# Altium project WIFI_BLE_Sound.PrjPcb
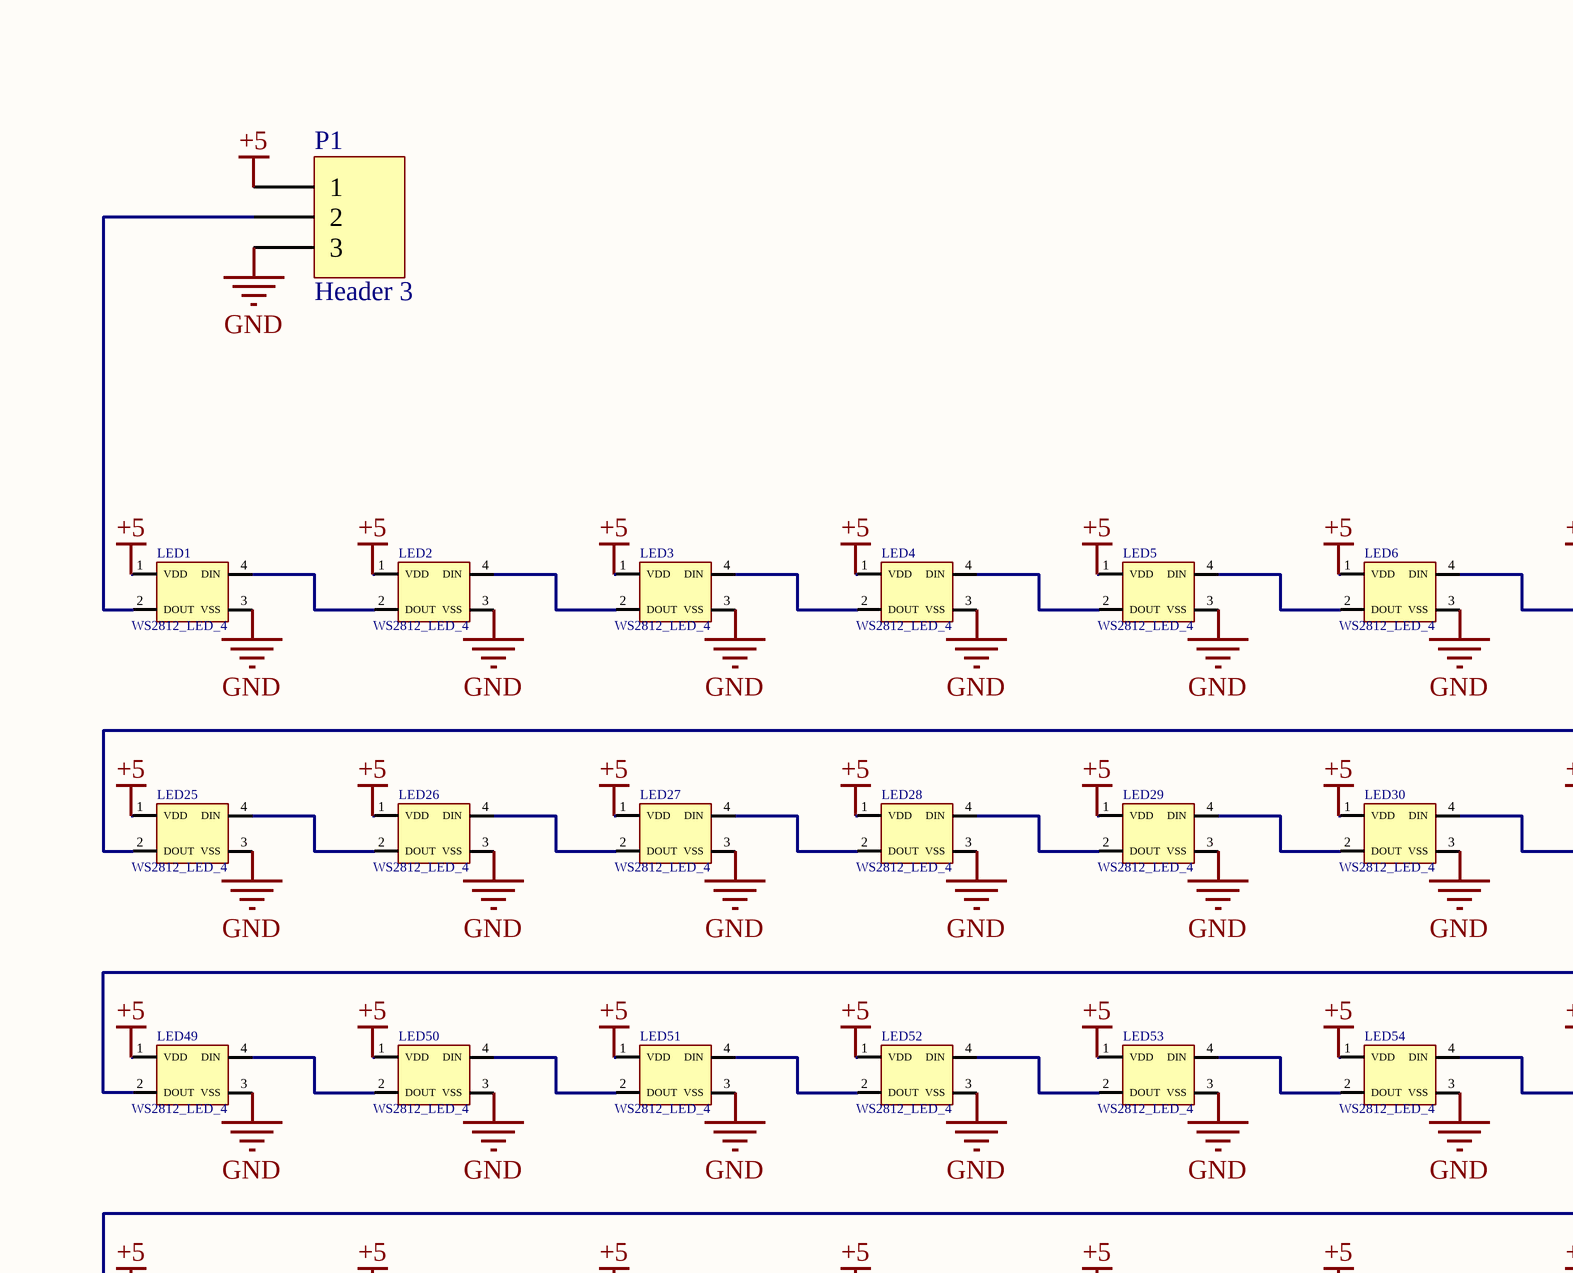
[diagram p0: Sheet1.SchDoc, top column 1 of 4]
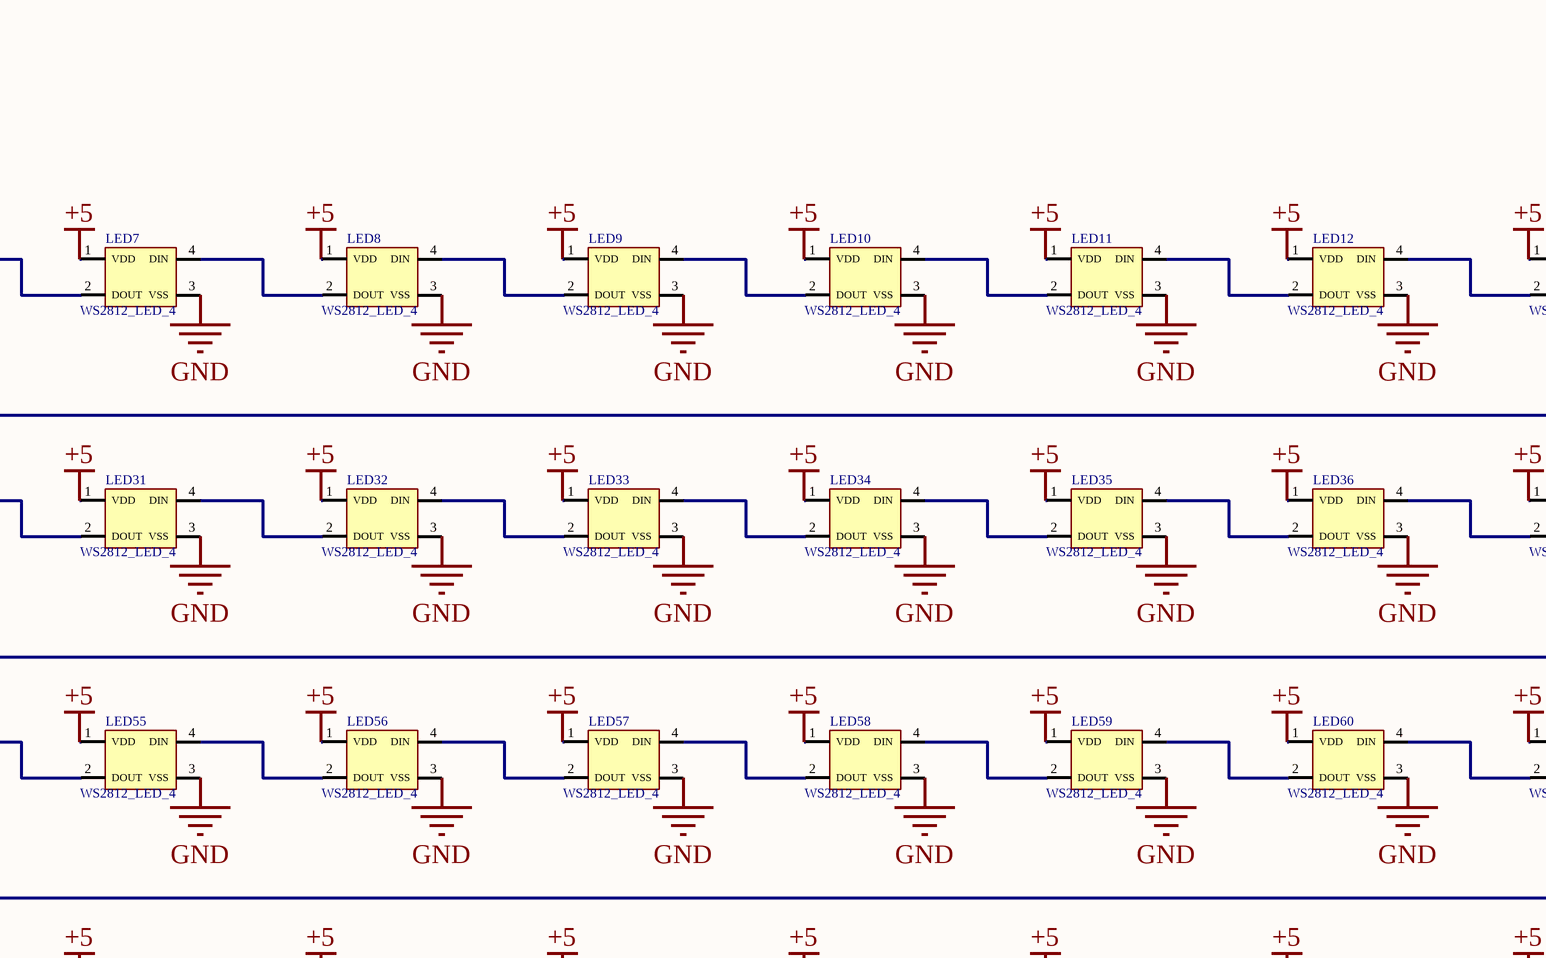
[diagram p1: Sheet1.SchDoc, top column 2 of 4]
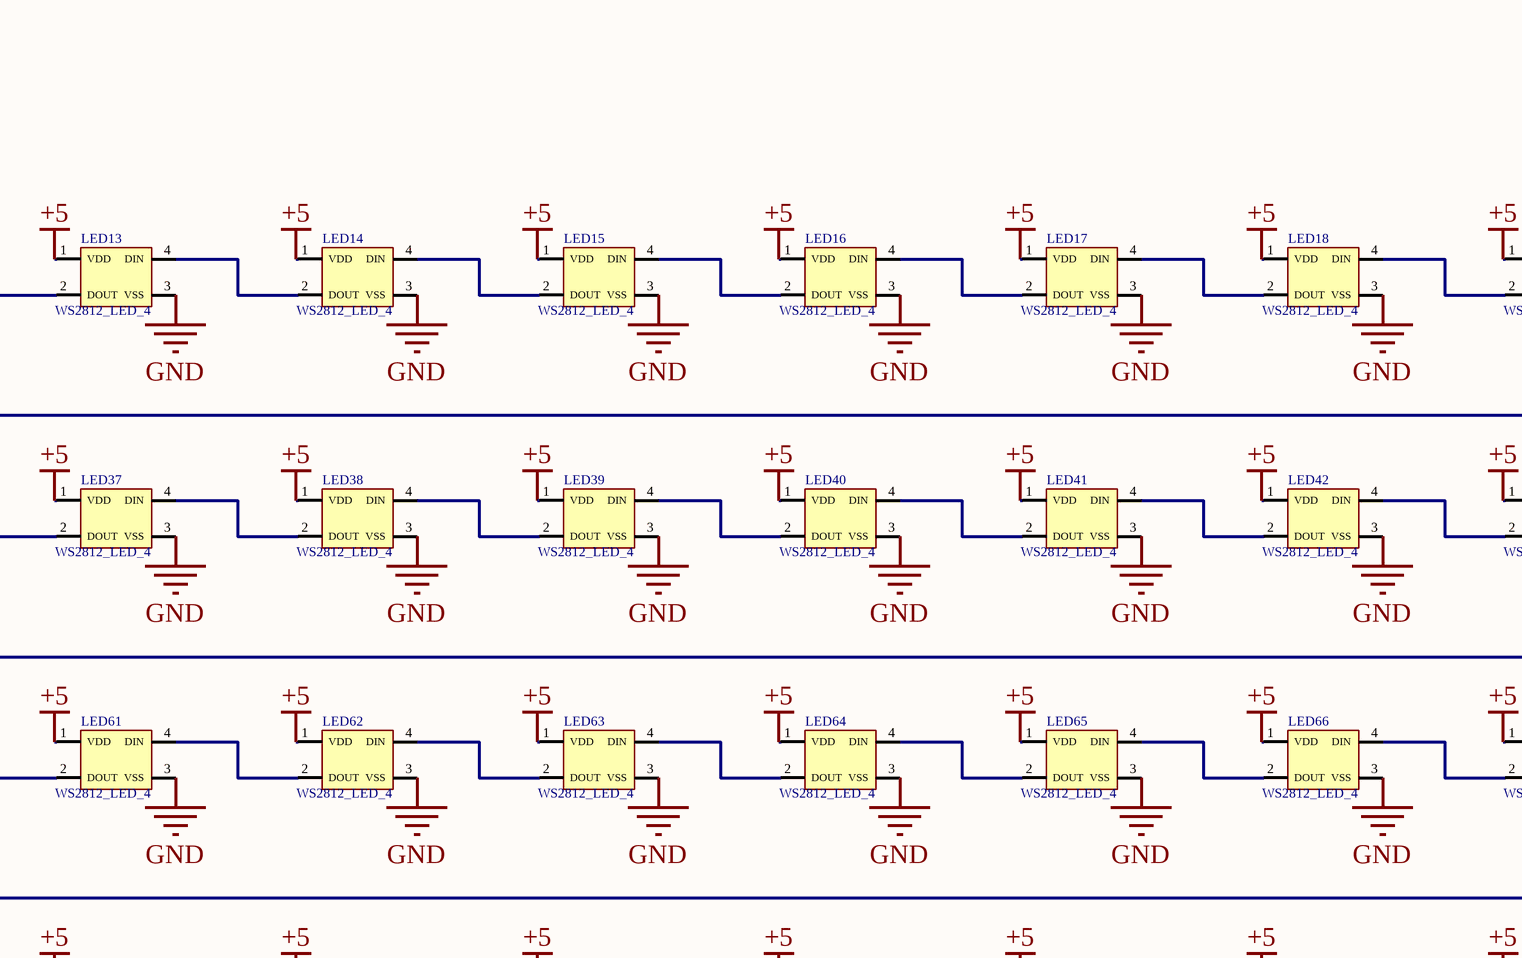
[diagram p2: Sheet1.SchDoc, top column 3 of 4]
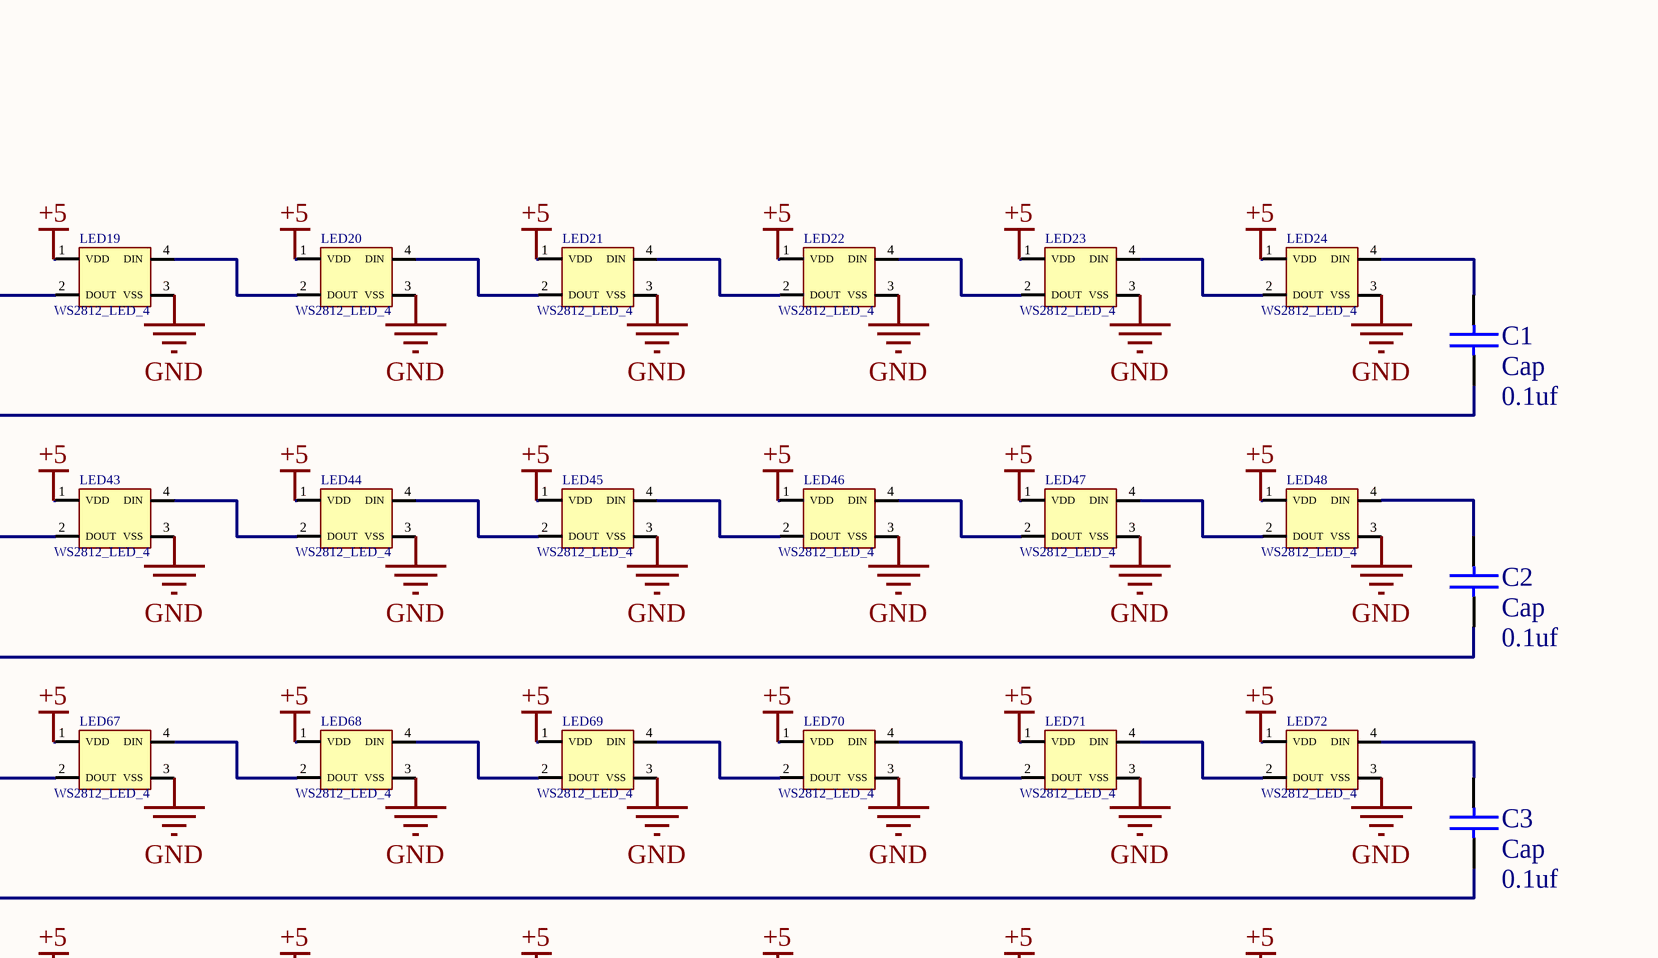
[diagram p3: Sheet1.SchDoc, top column 4 of 4]
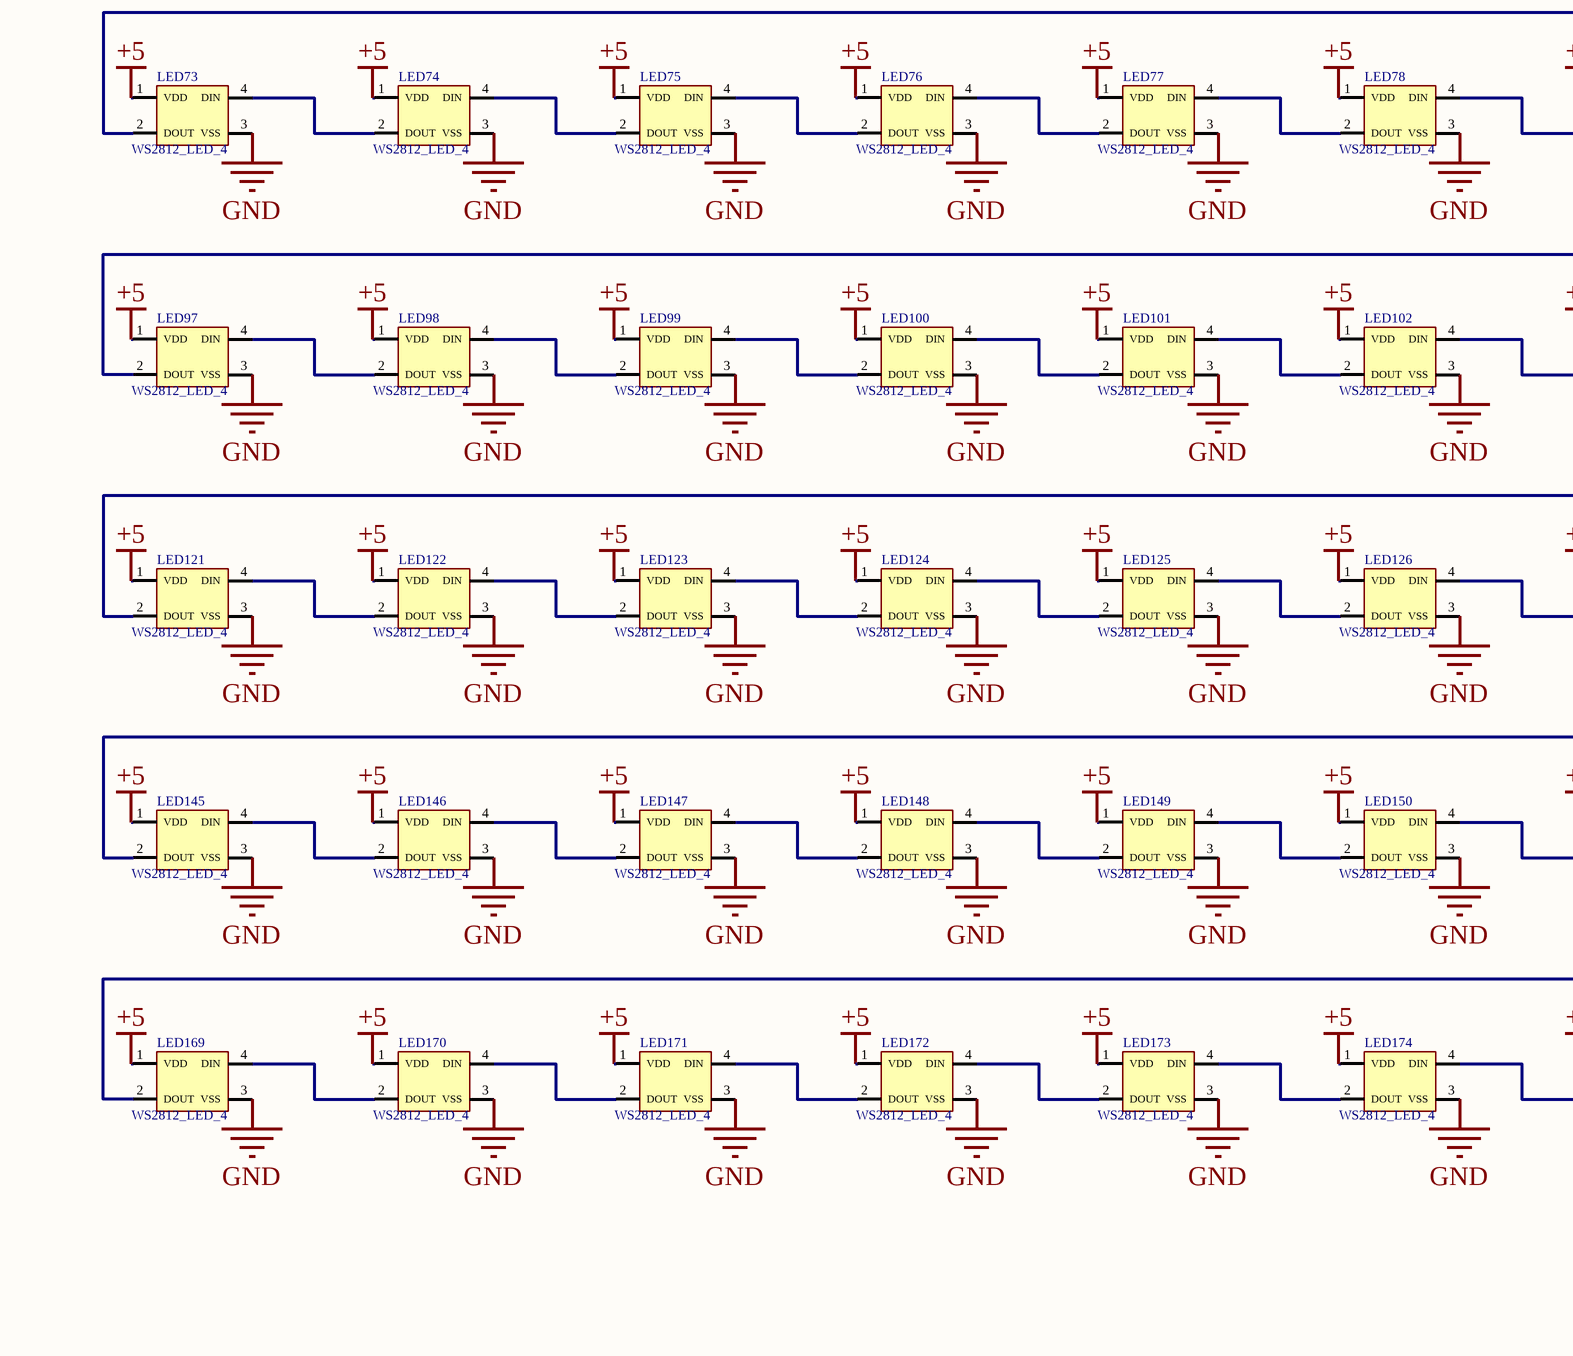
[diagram p4: Sheet1.SchDoc, bottom column 1 of 4]
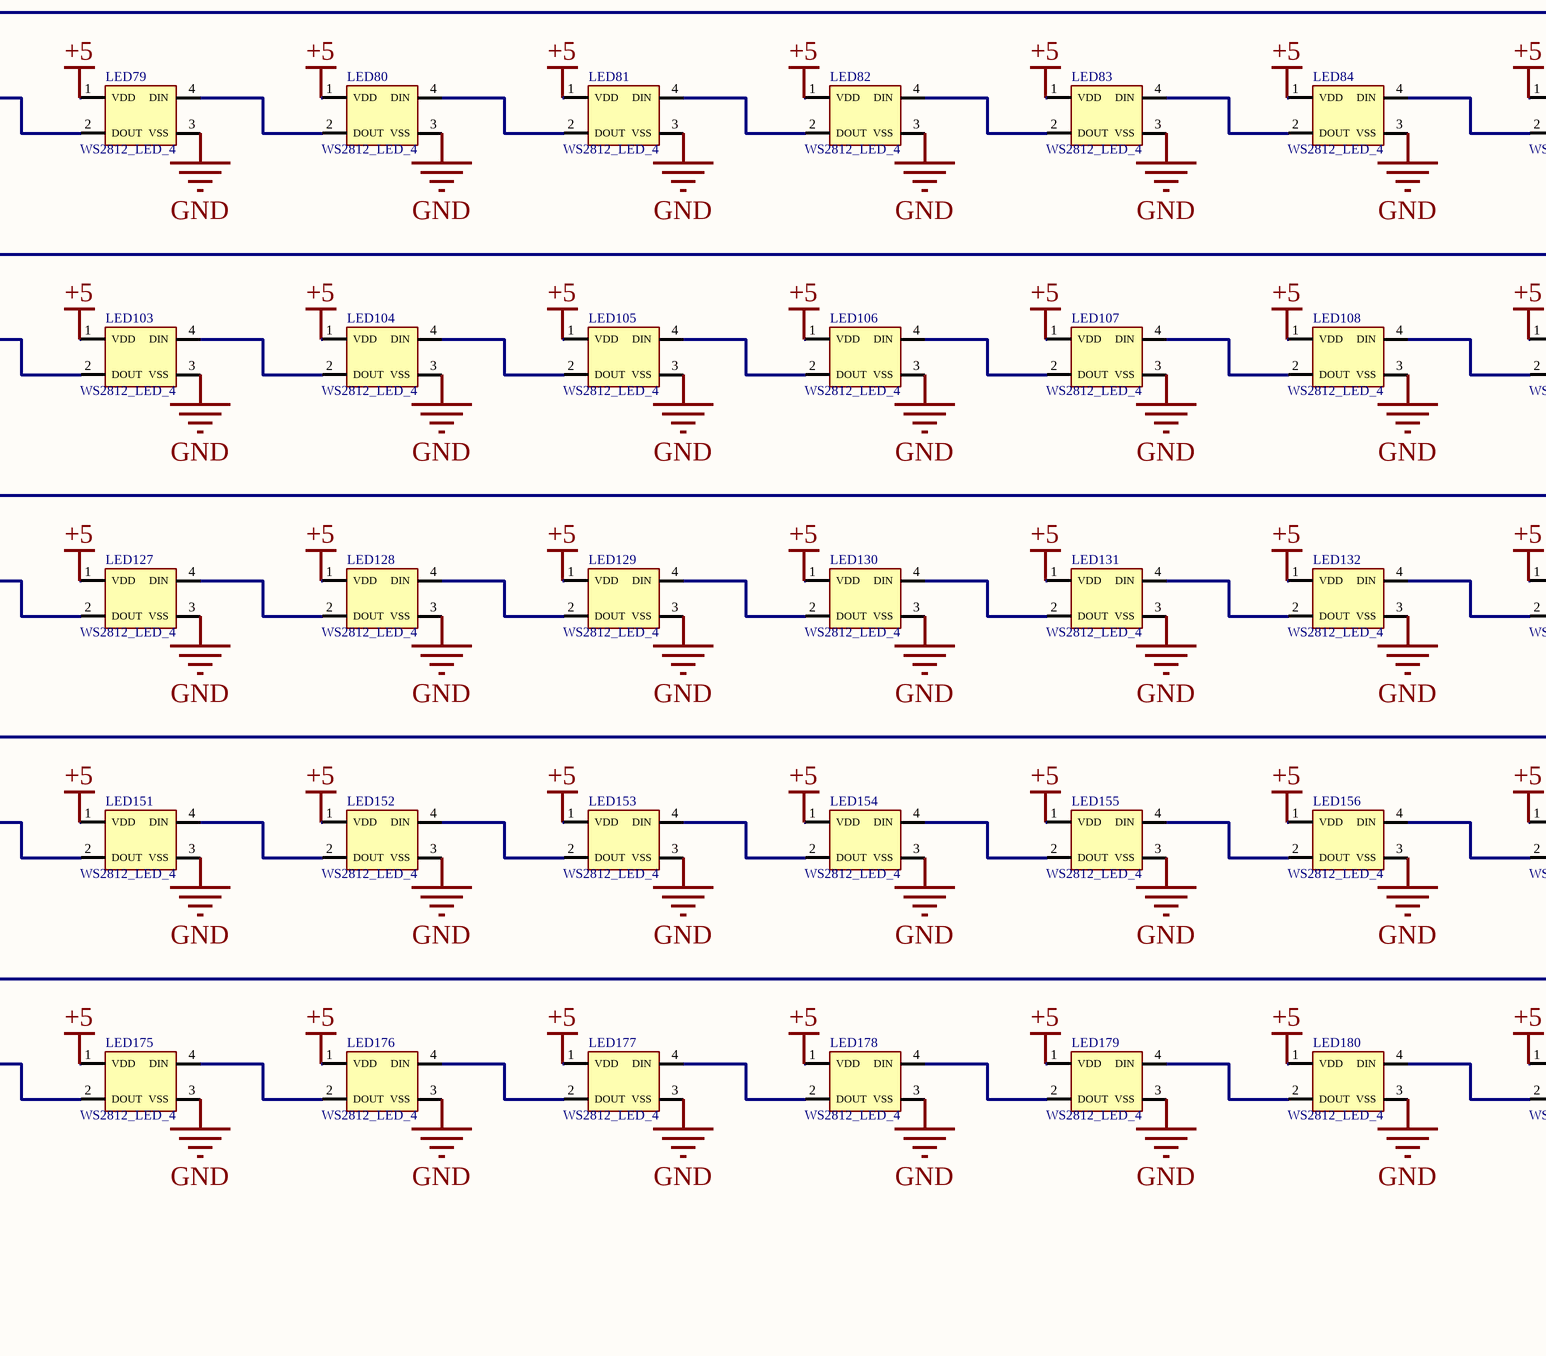
[diagram p5: Sheet1.SchDoc, bottom column 2 of 4]
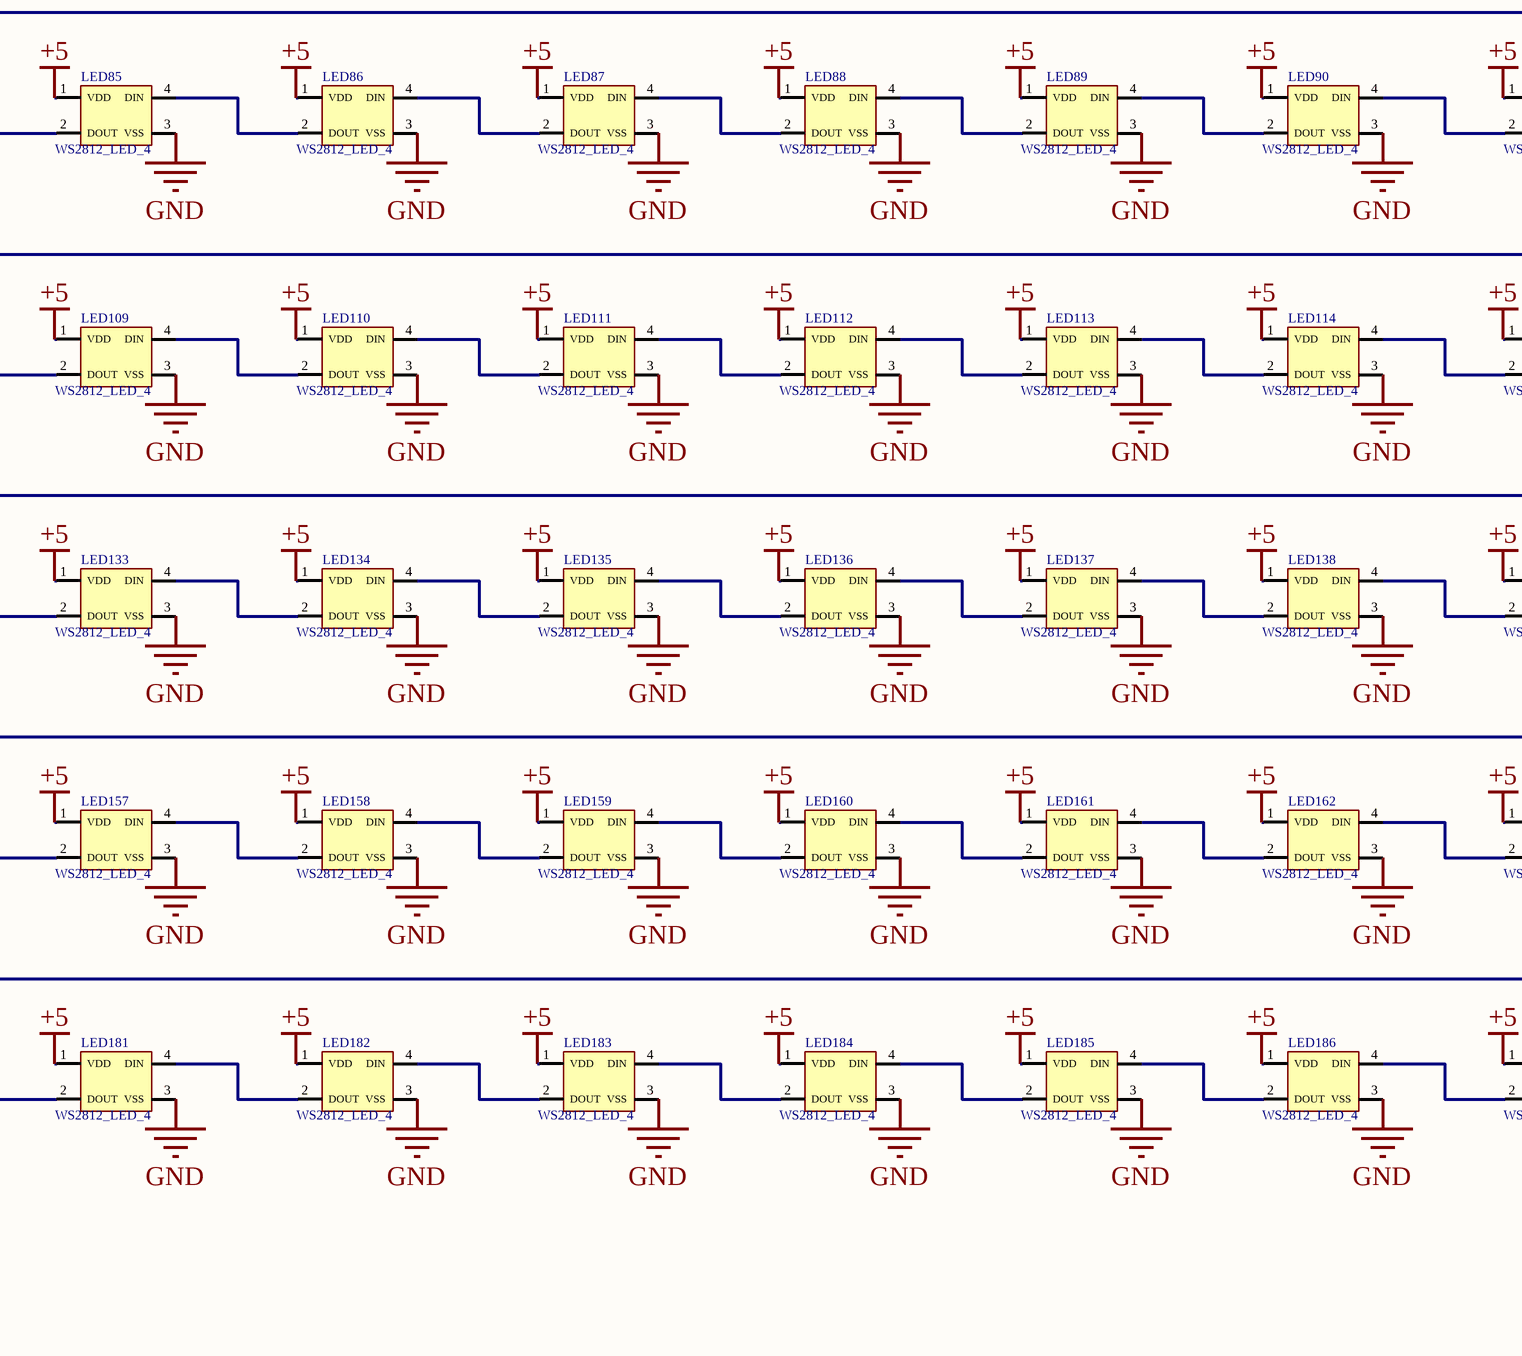
[diagram p6: Sheet1.SchDoc, bottom column 3 of 4]
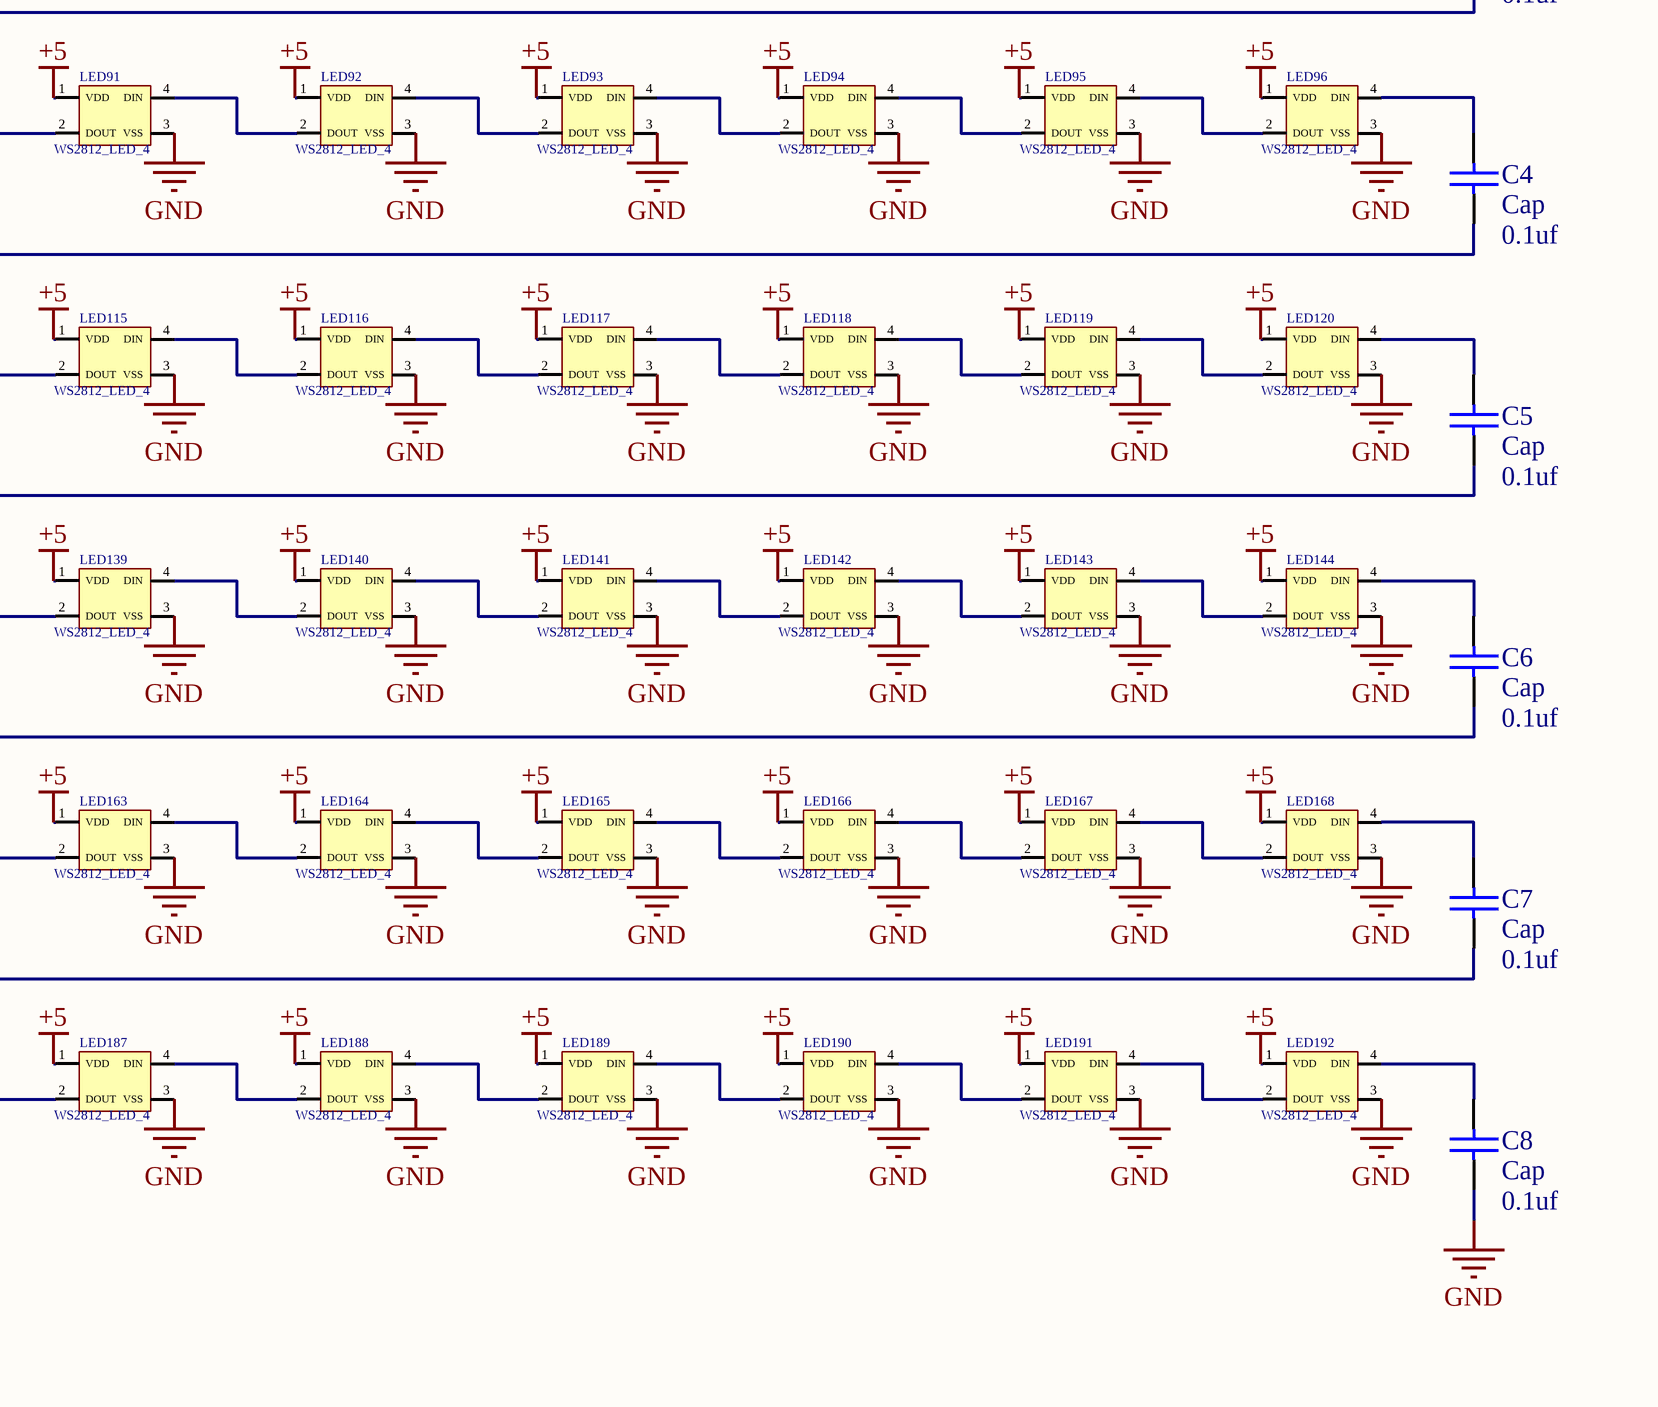
[diagram p7: Sheet1.SchDoc, bottom column 4 of 4]
1 sheet, 201 parts. Net scope: global (net labels, ports and power ports of the same name join across sheets).
Board file: PCB1.PcbDoc

## Sheet Sheet1.SchDoc
size A2; SheetNumber: 1; SheetTotal: 1; SPICEModelCacheAGTCYLVP: <root> / <DocumentId>AGTCYLVP</DocumentId> / <CacheFrame Number="0"> / <Model Name="cap" Kind="MDL"> / <Text>*Default semiconductor capacitor / .MODEL CAP C()</Text> / </Model> / </CacheFrame> / </root>

### Parts
C1  Cap  value 0.1uf  [RAD-0.3]
C2  Cap  value 0.1uf  [RAD-0.3]
C3  Cap  value 0.1uf  [RAD-0.3]
C4  Cap  value 0.1uf  [RAD-0.3]
C5  Cap  value 0.1uf  [RAD-0.3]
C6  Cap  value 0.1uf  [RAD-0.3]
C7  Cap  value 0.1uf  [RAD-0.3]
C8  Cap  value 0.1uf  [RAD-0.3]
LED1  WS2812_LED_4  [WS2812_LED_4]
LED2  WS2812_LED_4  [WS2812_LED_4]
LED3  WS2812_LED_4  [WS2812_LED_4]
LED4  WS2812_LED_4  [WS2812_LED_4]
LED5  WS2812_LED_4  [WS2812_LED_4]
LED6  WS2812_LED_4  [WS2812_LED_4]
LED7  WS2812_LED_4  [WS2812_LED_4]
LED8  WS2812_LED_4  [WS2812_LED_4]
LED9  WS2812_LED_4  [WS2812_LED_4]
LED10  WS2812_LED_4  [WS2812_LED_4]
LED11  WS2812_LED_4  [WS2812_LED_4]
LED12  WS2812_LED_4  [WS2812_LED_4]
LED13  WS2812_LED_4  [WS2812_LED_4]
LED14  WS2812_LED_4  [WS2812_LED_4]
LED15  WS2812_LED_4  [WS2812_LED_4]
LED16  WS2812_LED_4  [WS2812_LED_4]
LED17  WS2812_LED_4  [WS2812_LED_4]
LED18  WS2812_LED_4  [WS2812_LED_4]
LED19  WS2812_LED_4  [WS2812_LED_4]
LED20  WS2812_LED_4  [WS2812_LED_4]
LED21  WS2812_LED_4  [WS2812_LED_4]
LED22  WS2812_LED_4  [WS2812_LED_4]
LED23  WS2812_LED_4  [WS2812_LED_4]
LED24  WS2812_LED_4  [WS2812_LED_4]
LED25  WS2812_LED_4  [WS2812_LED_4]
LED26  WS2812_LED_4  [WS2812_LED_4]
LED27  WS2812_LED_4  [WS2812_LED_4]
LED28  WS2812_LED_4  [WS2812_LED_4]
LED29  WS2812_LED_4  [WS2812_LED_4]
LED30  WS2812_LED_4  [WS2812_LED_4]
LED31  WS2812_LED_4  [WS2812_LED_4]
LED32  WS2812_LED_4  [WS2812_LED_4]
LED33  WS2812_LED_4  [WS2812_LED_4]
LED34  WS2812_LED_4  [WS2812_LED_4]
LED35  WS2812_LED_4  [WS2812_LED_4]
LED36  WS2812_LED_4  [WS2812_LED_4]
LED37  WS2812_LED_4  [WS2812_LED_4]
LED38  WS2812_LED_4  [WS2812_LED_4]
LED39  WS2812_LED_4  [WS2812_LED_4]
LED40  WS2812_LED_4  [WS2812_LED_4]
LED41  WS2812_LED_4  [WS2812_LED_4]
LED42  WS2812_LED_4  [WS2812_LED_4]
LED43  WS2812_LED_4  [WS2812_LED_4]
LED44  WS2812_LED_4  [WS2812_LED_4]
LED45  WS2812_LED_4  [WS2812_LED_4]
LED46  WS2812_LED_4  [WS2812_LED_4]
LED47  WS2812_LED_4  [WS2812_LED_4]
LED48  WS2812_LED_4  [WS2812_LED_4]
LED49  WS2812_LED_4  [WS2812_LED_4]
LED50  WS2812_LED_4  [WS2812_LED_4]
LED51  WS2812_LED_4  [WS2812_LED_4]
LED52  WS2812_LED_4  [WS2812_LED_4]
LED53  WS2812_LED_4  [WS2812_LED_4]
LED54  WS2812_LED_4  [WS2812_LED_4]
LED55  WS2812_LED_4  [WS2812_LED_4]
LED56  WS2812_LED_4  [WS2812_LED_4]
LED57  WS2812_LED_4  [WS2812_LED_4]
LED58  WS2812_LED_4  [WS2812_LED_4]
LED59  WS2812_LED_4  [WS2812_LED_4]
LED60  WS2812_LED_4  [WS2812_LED_4]
LED61  WS2812_LED_4  [WS2812_LED_4]
LED62  WS2812_LED_4  [WS2812_LED_4]
LED63  WS2812_LED_4  [WS2812_LED_4]
LED64  WS2812_LED_4  [WS2812_LED_4]
LED65  WS2812_LED_4  [WS2812_LED_4]
LED66  WS2812_LED_4  [WS2812_LED_4]
LED67  WS2812_LED_4  [WS2812_LED_4]
LED68  WS2812_LED_4  [WS2812_LED_4]
LED69  WS2812_LED_4  [WS2812_LED_4]
LED70  WS2812_LED_4  [WS2812_LED_4]
LED71  WS2812_LED_4  [WS2812_LED_4]
LED72  WS2812_LED_4  [WS2812_LED_4]
LED73  WS2812_LED_4  [WS2812_LED_4]
LED74  WS2812_LED_4  [WS2812_LED_4]
LED75  WS2812_LED_4  [WS2812_LED_4]
LED76  WS2812_LED_4  [WS2812_LED_4]
LED77  WS2812_LED_4  [WS2812_LED_4]
LED78  WS2812_LED_4  [WS2812_LED_4]
LED79  WS2812_LED_4  [WS2812_LED_4]
LED80  WS2812_LED_4  [WS2812_LED_4]
LED81  WS2812_LED_4  [WS2812_LED_4]
LED82  WS2812_LED_4  [WS2812_LED_4]
LED83  WS2812_LED_4  [WS2812_LED_4]
LED84  WS2812_LED_4  [WS2812_LED_4]
LED85  WS2812_LED_4  [WS2812_LED_4]
LED86  WS2812_LED_4  [WS2812_LED_4]
LED87  WS2812_LED_4  [WS2812_LED_4]
LED88  WS2812_LED_4  [WS2812_LED_4]
LED89  WS2812_LED_4  [WS2812_LED_4]
LED90  WS2812_LED_4  [WS2812_LED_4]
LED91  WS2812_LED_4  [WS2812_LED_4]
LED92  WS2812_LED_4  [WS2812_LED_4]
LED93  WS2812_LED_4  [WS2812_LED_4]
LED94  WS2812_LED_4  [WS2812_LED_4]
LED95  WS2812_LED_4  [WS2812_LED_4]
LED96  WS2812_LED_4  [WS2812_LED_4]
LED97  WS2812_LED_4  [WS2812_LED_4]
LED98  WS2812_LED_4  [WS2812_LED_4]
LED99  WS2812_LED_4  [WS2812_LED_4]
LED100  WS2812_LED_4  [WS2812_LED_4]
LED101  WS2812_LED_4  [WS2812_LED_4]
LED102  WS2812_LED_4  [WS2812_LED_4]
LED103  WS2812_LED_4  [WS2812_LED_4]
LED104  WS2812_LED_4  [WS2812_LED_4]
LED105  WS2812_LED_4  [WS2812_LED_4]
LED106  WS2812_LED_4  [WS2812_LED_4]
LED107  WS2812_LED_4  [WS2812_LED_4]
LED108  WS2812_LED_4  [WS2812_LED_4]
LED109  WS2812_LED_4  [WS2812_LED_4]
LED110  WS2812_LED_4  [WS2812_LED_4]
LED111  WS2812_LED_4  [WS2812_LED_4]
LED112  WS2812_LED_4  [WS2812_LED_4]
LED113  WS2812_LED_4  [WS2812_LED_4]
LED114  WS2812_LED_4  [WS2812_LED_4]
LED115  WS2812_LED_4  [WS2812_LED_4]
LED116  WS2812_LED_4  [WS2812_LED_4]
LED117  WS2812_LED_4  [WS2812_LED_4]
LED118  WS2812_LED_4  [WS2812_LED_4]
LED119  WS2812_LED_4  [WS2812_LED_4]
LED120  WS2812_LED_4  [WS2812_LED_4]
LED121  WS2812_LED_4  [WS2812_LED_4]
LED122  WS2812_LED_4  [WS2812_LED_4]
LED123  WS2812_LED_4  [WS2812_LED_4]
LED124  WS2812_LED_4  [WS2812_LED_4]
LED125  WS2812_LED_4  [WS2812_LED_4]
LED126  WS2812_LED_4  [WS2812_LED_4]
LED127  WS2812_LED_4  [WS2812_LED_4]
LED128  WS2812_LED_4  [WS2812_LED_4]
LED129  WS2812_LED_4  [WS2812_LED_4]
LED130  WS2812_LED_4  [WS2812_LED_4]
LED131  WS2812_LED_4  [WS2812_LED_4]
LED132  WS2812_LED_4  [WS2812_LED_4]
LED133  WS2812_LED_4  [WS2812_LED_4]
LED134  WS2812_LED_4  [WS2812_LED_4]
LED135  WS2812_LED_4  [WS2812_LED_4]
LED136  WS2812_LED_4  [WS2812_LED_4]
LED137  WS2812_LED_4  [WS2812_LED_4]
LED138  WS2812_LED_4  [WS2812_LED_4]
LED139  WS2812_LED_4  [WS2812_LED_4]
LED140  WS2812_LED_4  [WS2812_LED_4]
LED141  WS2812_LED_4  [WS2812_LED_4]
LED142  WS2812_LED_4  [WS2812_LED_4]
LED143  WS2812_LED_4  [WS2812_LED_4]
LED144  WS2812_LED_4  [WS2812_LED_4]
LED145  WS2812_LED_4  [WS2812_LED_4]
LED146  WS2812_LED_4  [WS2812_LED_4]
LED147  WS2812_LED_4  [WS2812_LED_4]
LED148  WS2812_LED_4  [WS2812_LED_4]
LED149  WS2812_LED_4  [WS2812_LED_4]
LED150  WS2812_LED_4  [WS2812_LED_4]
LED151  WS2812_LED_4  [WS2812_LED_4]
LED152  WS2812_LED_4  [WS2812_LED_4]
LED153  WS2812_LED_4  [WS2812_LED_4]
LED154  WS2812_LED_4  [WS2812_LED_4]
LED155  WS2812_LED_4  [WS2812_LED_4]
LED156  WS2812_LED_4  [WS2812_LED_4]
LED157  WS2812_LED_4  [WS2812_LED_4]
LED158  WS2812_LED_4  [WS2812_LED_4]
LED159  WS2812_LED_4  [WS2812_LED_4]
LED160  WS2812_LED_4  [WS2812_LED_4]
LED161  WS2812_LED_4  [WS2812_LED_4]
LED162  WS2812_LED_4  [WS2812_LED_4]
LED163  WS2812_LED_4  [WS2812_LED_4]
LED164  WS2812_LED_4  [WS2812_LED_4]
LED165  WS2812_LED_4  [WS2812_LED_4]
LED166  WS2812_LED_4  [WS2812_LED_4]
LED167  WS2812_LED_4  [WS2812_LED_4]
LED168  WS2812_LED_4  [WS2812_LED_4]
LED169  WS2812_LED_4  [WS2812_LED_4]
LED170  WS2812_LED_4  [WS2812_LED_4]
LED171  WS2812_LED_4  [WS2812_LED_4]
LED172  WS2812_LED_4  [WS2812_LED_4]
LED173  WS2812_LED_4  [WS2812_LED_4]
LED174  WS2812_LED_4  [WS2812_LED_4]
LED175  WS2812_LED_4  [WS2812_LED_4]
LED176  WS2812_LED_4  [WS2812_LED_4]
LED177  WS2812_LED_4  [WS2812_LED_4]
LED178  WS2812_LED_4  [WS2812_LED_4]
LED179  WS2812_LED_4  [WS2812_LED_4]
LED180  WS2812_LED_4  [WS2812_LED_4]
LED181  WS2812_LED_4  [WS2812_LED_4]
LED182  WS2812_LED_4  [WS2812_LED_4]
LED183  WS2812_LED_4  [WS2812_LED_4]
LED184  WS2812_LED_4  [WS2812_LED_4]
LED185  WS2812_LED_4  [WS2812_LED_4]
LED186  WS2812_LED_4  [WS2812_LED_4]
LED187  WS2812_LED_4  [WS2812_LED_4]
LED188  WS2812_LED_4  [WS2812_LED_4]
LED189  WS2812_LED_4  [WS2812_LED_4]
LED190  WS2812_LED_4  [WS2812_LED_4]
LED191  WS2812_LED_4  [WS2812_LED_4]
LED192  WS2812_LED_4  [WS2812_LED_4]
P1  Header 3  [HDR1X3]

### Nets
+5: LED1.1(VDD) LED2.1(VDD) LED3.1(VDD) LED4.1(VDD) LED5.1(VDD) LED6.1(VDD) LED7.1(VDD) LED8.1(VDD) LED9.1(VDD) LED10.1(VDD) LED11.1(VDD) LED12.1(VDD) LED13.1(VDD) LED14.1(VDD) LED15.1(VDD) LED16.1(VDD) LED17.1(VDD) LED18.1(VDD) LED19.1(VDD) LED20.1(VDD) LED21.1(VDD) LED22.1(VDD) LED23.1(VDD) LED24.1(VDD) LED25.1(VDD) LED26.1(VDD) LED27.1(VDD) LED28.1(VDD) LED29.1(VDD) LED30.1(VDD) LED31.1(VDD) LED32.1(VDD) LED33.1(VDD) LED34.1(VDD) LED35.1(VDD) LED36.1(VDD) LED37.1(VDD) LED38.1(VDD) LED39.1(VDD) LED40.1(VDD) LED41.1(VDD) LED42.1(VDD) LED43.1(VDD) LED44.1(VDD) LED45.1(VDD) LED46.1(VDD) LED47.1(VDD) LED48.1(VDD) LED49.1(VDD) LED50.1(VDD) LED51.1(VDD) LED52.1(VDD) LED53.1(VDD) LED54.1(VDD) LED55.1(VDD) LED56.1(VDD) LED57.1(VDD) LED58.1(VDD) LED59.1(VDD) LED60.1(VDD) LED61.1(VDD) LED62.1(VDD) LED63.1(VDD) LED64.1(VDD) LED65.1(VDD) LED66.1(VDD) LED67.1(VDD) LED68.1(VDD) LED69.1(VDD) LED70.1(VDD) LED71.1(VDD) LED72.1(VDD) LED73.1(VDD) LED74.1(VDD) LED75.1(VDD) LED76.1(VDD) LED77.1(VDD) LED78.1(VDD) LED79.1(VDD) LED80.1(VDD) LED81.1(VDD) LED82.1(VDD) LED83.1(VDD) LED84.1(VDD) LED85.1(VDD) LED86.1(VDD) LED87.1(VDD) LED88.1(VDD) LED89.1(VDD) LED90.1(VDD) LED91.1(VDD) LED92.1(VDD) LED93.1(VDD) LED94.1(VDD) LED95.1(VDD) LED96.1(VDD) LED97.1(VDD) LED98.1(VDD) LED99.1(VDD) LED100.1(VDD) LED101.1(VDD) LED102.1(VDD) LED103.1(VDD) LED104.1(VDD) LED105.1(VDD) LED106.1(VDD) LED107.1(VDD) LED108.1(VDD) LED109.1(VDD) LED110.1(VDD) LED111.1(VDD) LED112.1(VDD) LED113.1(VDD) LED114.1(VDD) LED115.1(VDD) LED116.1(VDD) LED117.1(VDD) LED118.1(VDD) LED119.1(VDD) LED120.1(VDD) LED121.1(VDD) LED122.1(VDD) LED123.1(VDD) LED124.1(VDD) LED125.1(VDD) LED126.1(VDD) LED127.1(VDD) LED128.1(VDD) LED129.1(VDD) LED130.1(VDD) LED131.1(VDD) LED132.1(VDD) LED133.1(VDD) LED134.1(VDD) LED135.1(VDD) LED136.1(VDD) LED137.1(VDD) LED138.1(VDD) LED139.1(VDD) LED140.1(VDD) LED141.1(VDD) LED142.1(VDD) LED143.1(VDD) LED144.1(VDD) LED145.1(VDD) LED146.1(VDD) LED147.1(VDD) LED148.1(VDD) LED149.1(VDD) LED150.1(VDD) LED151.1(VDD) LED152.1(VDD) LED153.1(VDD) LED154.1(VDD) LED155.1(VDD) LED156.1(VDD) LED157.1(VDD) LED158.1(VDD) LED159.1(VDD) LED160.1(VDD) LED161.1(VDD) LED162.1(VDD) LED163.1(VDD) LED164.1(VDD) LED165.1(VDD) LED166.1(VDD) LED167.1(VDD) LED168.1(VDD) LED169.1(VDD) LED170.1(VDD) LED171.1(VDD) LED172.1(VDD) LED173.1(VDD) LED174.1(VDD) LED175.1(VDD) LED176.1(VDD) LED177.1(VDD) LED178.1(VDD) LED179.1(VDD) LED180.1(VDD) LED181.1(VDD) LED182.1(VDD) LED183.1(VDD) LED184.1(VDD) LED185.1(VDD) LED186.1(VDD) LED187.1(VDD) LED188.1(VDD) LED189.1(VDD) LED190.1(VDD) LED191.1(VDD) LED192.1(VDD) P1.1
GND: C8.1 LED1.3(VSS) LED2.3(VSS) LED3.3(VSS) LED4.3(VSS) LED5.3(VSS) LED6.3(VSS) LED7.3(VSS) LED8.3(VSS) LED9.3(VSS) LED10.3(VSS) LED11.3(VSS) LED12.3(VSS) LED13.3(VSS) LED14.3(VSS) LED15.3(VSS) LED16.3(VSS) LED17.3(VSS) LED18.3(VSS) LED19.3(VSS) LED20.3(VSS) LED21.3(VSS) LED22.3(VSS) LED23.3(VSS) LED24.3(VSS) LED25.3(VSS) LED26.3(VSS) LED27.3(VSS) LED28.3(VSS) LED29.3(VSS) LED30.3(VSS) LED31.3(VSS) LED32.3(VSS) LED33.3(VSS) LED34.3(VSS) LED35.3(VSS) LED36.3(VSS) LED37.3(VSS) LED38.3(VSS) LED39.3(VSS) LED40.3(VSS) LED41.3(VSS) LED42.3(VSS) LED43.3(VSS) LED44.3(VSS) LED45.3(VSS) LED46.3(VSS) LED47.3(VSS) LED48.3(VSS) LED49.3(VSS) LED50.3(VSS) LED51.3(VSS) LED52.3(VSS) LED53.3(VSS) LED54.3(VSS) LED55.3(VSS) LED56.3(VSS) LED57.3(VSS) LED58.3(VSS) LED59.3(VSS) LED60.3(VSS) LED61.3(VSS) LED62.3(VSS) LED63.3(VSS) LED64.3(VSS) LED65.3(VSS) LED66.3(VSS) LED67.3(VSS) LED68.3(VSS) LED69.3(VSS) LED70.3(VSS) LED71.3(VSS) LED72.3(VSS) LED73.3(VSS) LED74.3(VSS) LED75.3(VSS) LED76.3(VSS) LED77.3(VSS) LED78.3(VSS) LED79.3(VSS) LED80.3(VSS) LED81.3(VSS) LED82.3(VSS) LED83.3(VSS) LED84.3(VSS) LED85.3(VSS) LED86.3(VSS) LED87.3(VSS) LED88.3(VSS) LED89.3(VSS) LED90.3(VSS) LED91.3(VSS) LED92.3(VSS) LED93.3(VSS) LED94.3(VSS) LED95.3(VSS) LED96.3(VSS) LED97.3(VSS) LED98.3(VSS) LED99.3(VSS) LED100.3(VSS) LED101.3(VSS) LED102.3(VSS) LED103.3(VSS) LED104.3(VSS) LED105.3(VSS) LED106.3(VSS) LED107.3(VSS) LED108.3(VSS) LED109.3(VSS) LED110.3(VSS) LED111.3(VSS) LED112.3(VSS) LED113.3(VSS) LED114.3(VSS) LED115.3(VSS) LED116.3(VSS) LED117.3(VSS) LED118.3(VSS) LED119.3(VSS) LED120.3(VSS) LED121.3(VSS) LED122.3(VSS) LED123.3(VSS) LED124.3(VSS) LED125.3(VSS) LED126.3(VSS) LED127.3(VSS) LED128.3(VSS) LED129.3(VSS) LED130.3(VSS) LED131.3(VSS) LED132.3(VSS) LED133.3(VSS) LED134.3(VSS) LED135.3(VSS) LED136.3(VSS) LED137.3(VSS) LED138.3(VSS) LED139.3(VSS) LED140.3(VSS) LED141.3(VSS) LED142.3(VSS) LED143.3(VSS) LED144.3(VSS) LED145.3(VSS) LED146.3(VSS) LED147.3(VSS) LED148.3(VSS) LED149.3(VSS) LED150.3(VSS) LED151.3(VSS) LED152.3(VSS) LED153.3(VSS) LED154.3(VSS) LED155.3(VSS) LED156.3(VSS) LED157.3(VSS) LED158.3(VSS) LED159.3(VSS) LED160.3(VSS) LED161.3(VSS) LED162.3(VSS) LED163.3(VSS) LED164.3(VSS) LED165.3(VSS) LED166.3(VSS) LED167.3(VSS) LED168.3(VSS) LED169.3(VSS) LED170.3(VSS) LED171.3(VSS) LED172.3(VSS) LED173.3(VSS) LED174.3(VSS) LED175.3(VSS) LED176.3(VSS) LED177.3(VSS) LED178.3(VSS) LED179.3(VSS) LED180.3(VSS) LED181.3(VSS) LED182.3(VSS) LED183.3(VSS) LED184.3(VSS) LED185.3(VSS) LED186.3(VSS) LED187.3(VSS) LED188.3(VSS) LED189.3(VSS) LED190.3(VSS) LED191.3(VSS) LED192.3(VSS) P1.3
NetC1_1: C1.1 LED25.2(DOUT)
NetC1_2: C1.2 LED24.4(DIN)
NetC2_1: C2.1 LED49.2(DOUT)
NetC2_2: C2.2 LED48.4(DIN)
NetC3_1: C3.1 LED73.2(DOUT)
NetC3_2: C3.2 LED72.4(DIN)
NetC4_1: C4.1 LED97.2(DOUT)
NetC4_2: C4.2 LED96.4(DIN)
NetC5_1: C5.1 LED121.2(DOUT)
NetC5_2: C5.2 LED120.4(DIN)
NetC6_1: C6.1 LED145.2(DOUT)
NetC6_2: C6.2 LED144.4(DIN)
NetC7_1: C7.1 LED169.2(DOUT)
NetC7_2: C7.2 LED168.4(DIN)
NetC8_2: C8.2 LED192.4(DIN)
NetLED1_2: LED1.2(DOUT) P1.2
NetLED1_4: LED1.4(DIN) LED2.2(DOUT)
NetLED2_4: LED2.4(DIN) LED3.2(DOUT)
NetLED3_4: LED3.4(DIN) LED4.2(DOUT)
NetLED4_4: LED4.4(DIN) LED5.2(DOUT)
NetLED5_4: LED5.4(DIN) LED6.2(DOUT)
NetLED6_4: LED6.4(DIN) LED7.2(DOUT)
NetLED7_4: LED7.4(DIN) LED8.2(DOUT)
NetLED8_4: LED8.4(DIN) LED9.2(DOUT)
NetLED9_4: LED9.4(DIN) LED10.2(DOUT)
NetLED10_4: LED10.4(DIN) LED11.2(DOUT)
NetLED11_4: LED11.4(DIN) LED12.2(DOUT)
NetLED12_4: LED12.4(DIN) LED13.2(DOUT)
NetLED13_4: LED13.4(DIN) LED14.2(DOUT)
NetLED14_4: LED14.4(DIN) LED15.2(DOUT)
NetLED15_4: LED15.4(DIN) LED16.2(DOUT)
NetLED16_4: LED16.4(DIN) LED17.2(DOUT)
NetLED17_4: LED17.4(DIN) LED18.2(DOUT)
NetLED18_4: LED18.4(DIN) LED19.2(DOUT)
NetLED19_4: LED19.4(DIN) LED20.2(DOUT)
NetLED20_4: LED20.4(DIN) LED21.2(DOUT)
NetLED21_4: LED21.4(DIN) LED22.2(DOUT)
NetLED22_4: LED22.4(DIN) LED23.2(DOUT)
NetLED23_4: LED23.4(DIN) LED24.2(DOUT)
NetLED25_4: LED25.4(DIN) LED26.2(DOUT)
NetLED26_4: LED26.4(DIN) LED27.2(DOUT)
NetLED27_4: LED27.4(DIN) LED28.2(DOUT)
NetLED28_4: LED28.4(DIN) LED29.2(DOUT)
NetLED29_4: LED29.4(DIN) LED30.2(DOUT)
NetLED30_4: LED30.4(DIN) LED31.2(DOUT)
NetLED31_4: LED31.4(DIN) LED32.2(DOUT)
NetLED32_4: LED32.4(DIN) LED33.2(DOUT)
NetLED33_4: LED33.4(DIN) LED34.2(DOUT)
NetLED34_4: LED34.4(DIN) LED35.2(DOUT)
NetLED35_4: LED35.4(DIN) LED36.2(DOUT)
NetLED36_4: LED36.4(DIN) LED37.2(DOUT)
NetLED37_4: LED37.4(DIN) LED38.2(DOUT)
NetLED38_4: LED38.4(DIN) LED39.2(DOUT)
NetLED39_4: LED39.4(DIN) LED40.2(DOUT)
NetLED40_4: LED40.4(DIN) LED41.2(DOUT)
NetLED41_4: LED41.4(DIN) LED42.2(DOUT)
NetLED42_4: LED42.4(DIN) LED43.2(DOUT)
NetLED43_4: LED43.4(DIN) LED44.2(DOUT)
NetLED44_4: LED44.4(DIN) LED45.2(DOUT)
NetLED45_4: LED45.4(DIN) LED46.2(DOUT)
NetLED46_4: LED46.4(DIN) LED47.2(DOUT)
NetLED47_4: LED47.4(DIN) LED48.2(DOUT)
NetLED49_4: LED49.4(DIN) LED50.2(DOUT)
NetLED50_4: LED50.4(DIN) LED51.2(DOUT)
NetLED51_4: LED51.4(DIN) LED52.2(DOUT)
NetLED52_4: LED52.4(DIN) LED53.2(DOUT)
NetLED53_4: LED53.4(DIN) LED54.2(DOUT)
NetLED54_4: LED54.4(DIN) LED55.2(DOUT)
NetLED55_4: LED55.4(DIN) LED56.2(DOUT)
NetLED56_4: LED56.4(DIN) LED57.2(DOUT)
NetLED57_4: LED57.4(DIN) LED58.2(DOUT)
NetLED58_4: LED58.4(DIN) LED59.2(DOUT)
NetLED59_4: LED59.4(DIN) LED60.2(DOUT)
NetLED60_4: LED60.4(DIN) LED61.2(DOUT)
NetLED61_4: LED61.4(DIN) LED62.2(DOUT)
NetLED62_4: LED62.4(DIN) LED63.2(DOUT)
NetLED63_4: LED63.4(DIN) LED64.2(DOUT)
NetLED64_4: LED64.4(DIN) LED65.2(DOUT)
NetLED65_4: LED65.4(DIN) LED66.2(DOUT)
NetLED66_4: LED66.4(DIN) LED67.2(DOUT)
NetLED67_4: LED67.4(DIN) LED68.2(DOUT)
NetLED68_4: LED68.4(DIN) LED69.2(DOUT)
NetLED69_4: LED69.4(DIN) LED70.2(DOUT)
NetLED70_4: LED70.4(DIN) LED71.2(DOUT)
NetLED71_4: LED71.4(DIN) LED72.2(DOUT)
NetLED73_4: LED73.4(DIN) LED74.2(DOUT)
NetLED74_4: LED74.4(DIN) LED75.2(DOUT)
NetLED75_4: LED75.4(DIN) LED76.2(DOUT)
NetLED76_4: LED76.4(DIN) LED77.2(DOUT)
NetLED77_4: LED77.4(DIN) LED78.2(DOUT)
NetLED78_4: LED78.4(DIN) LED79.2(DOUT)
NetLED79_4: LED79.4(DIN) LED80.2(DOUT)
NetLED80_4: LED80.4(DIN) LED81.2(DOUT)
NetLED81_4: LED81.4(DIN) LED82.2(DOUT)
NetLED82_4: LED82.4(DIN) LED83.2(DOUT)
NetLED83_4: LED83.4(DIN) LED84.2(DOUT)
NetLED84_4: LED84.4(DIN) LED85.2(DOUT)
NetLED85_4: LED85.4(DIN) LED86.2(DOUT)
NetLED86_4: LED86.4(DIN) LED87.2(DOUT)
NetLED87_4: LED87.4(DIN) LED88.2(DOUT)
NetLED88_4: LED88.4(DIN) LED89.2(DOUT)
NetLED89_4: LED89.4(DIN) LED90.2(DOUT)
NetLED90_4: LED90.4(DIN) LED91.2(DOUT)
NetLED91_4: LED91.4(DIN) LED92.2(DOUT)
NetLED92_4: LED92.4(DIN) LED93.2(DOUT)
NetLED93_4: LED93.4(DIN) LED94.2(DOUT)
NetLED94_4: LED94.4(DIN) LED95.2(DOUT)
NetLED95_4: LED95.4(DIN) LED96.2(DOUT)
NetLED97_4: LED97.4(DIN) LED98.2(DOUT)
NetLED98_4: LED98.4(DIN) LED99.2(DOUT)
NetLED99_4: LED99.4(DIN) LED100.2(DOUT)
NetLED100_4: LED100.4(DIN) LED101.2(DOUT)
NetLED101_4: LED101.4(DIN) LED102.2(DOUT)
NetLED102_4: LED102.4(DIN) LED103.2(DOUT)
NetLED103_4: LED103.4(DIN) LED104.2(DOUT)
NetLED104_4: LED104.4(DIN) LED105.2(DOUT)
NetLED105_4: LED105.4(DIN) LED106.2(DOUT)
NetLED106_4: LED106.4(DIN) LED107.2(DOUT)
NetLED107_4: LED107.4(DIN) LED108.2(DOUT)
NetLED108_4: LED108.4(DIN) LED109.2(DOUT)
NetLED109_4: LED109.4(DIN) LED110.2(DOUT)
NetLED110_4: LED110.4(DIN) LED111.2(DOUT)
NetLED111_4: LED111.4(DIN) LED112.2(DOUT)
NetLED112_4: LED112.4(DIN) LED113.2(DOUT)
NetLED113_4: LED113.4(DIN) LED114.2(DOUT)
NetLED114_4: LED114.4(DIN) LED115.2(DOUT)
NetLED115_4: LED115.4(DIN) LED116.2(DOUT)
NetLED116_4: LED116.4(DIN) LED117.2(DOUT)
NetLED117_4: LED117.4(DIN) LED118.2(DOUT)
NetLED118_4: LED118.4(DIN) LED119.2(DOUT)
NetLED119_4: LED119.4(DIN) LED120.2(DOUT)
NetLED121_4: LED121.4(DIN) LED122.2(DOUT)
NetLED122_4: LED122.4(DIN) LED123.2(DOUT)
NetLED123_4: LED123.4(DIN) LED124.2(DOUT)
NetLED124_4: LED124.4(DIN) LED125.2(DOUT)
NetLED125_4: LED125.4(DIN) LED126.2(DOUT)
NetLED126_4: LED126.4(DIN) LED127.2(DOUT)
NetLED127_4: LED127.4(DIN) LED128.2(DOUT)
NetLED128_4: LED128.4(DIN) LED129.2(DOUT)
NetLED129_4: LED129.4(DIN) LED130.2(DOUT)
NetLED130_4: LED130.4(DIN) LED131.2(DOUT)
NetLED131_4: LED131.4(DIN) LED132.2(DOUT)
NetLED132_4: LED132.4(DIN) LED133.2(DOUT)
NetLED133_4: LED133.4(DIN) LED134.2(DOUT)
NetLED134_4: LED134.4(DIN) LED135.2(DOUT)
NetLED135_4: LED135.4(DIN) LED136.2(DOUT)
NetLED136_4: LED136.4(DIN) LED137.2(DOUT)
NetLED137_4: LED137.4(DIN) LED138.2(DOUT)
NetLED138_4: LED138.4(DIN) LED139.2(DOUT)
NetLED139_4: LED139.4(DIN) LED140.2(DOUT)
NetLED140_4: LED140.4(DIN) LED141.2(DOUT)
NetLED141_4: LED141.4(DIN) LED142.2(DOUT)
NetLED142_4: LED142.4(DIN) LED143.2(DOUT)
NetLED143_4: LED143.4(DIN) LED144.2(DOUT)
NetLED145_4: LED145.4(DIN) LED146.2(DOUT)
NetLED146_4: LED146.4(DIN) LED147.2(DOUT)
NetLED147_4: LED147.4(DIN) LED148.2(DOUT)
NetLED148_4: LED148.4(DIN) LED149.2(DOUT)
NetLED149_4: LED149.4(DIN) LED150.2(DOUT)
NetLED150_4: LED150.4(DIN) LED151.2(DOUT)
NetLED151_4: LED151.4(DIN) LED152.2(DOUT)
NetLED152_4: LED152.4(DIN) LED153.2(DOUT)
NetLED153_4: LED153.4(DIN) LED154.2(DOUT)
NetLED154_4: LED154.4(DIN) LED155.2(DOUT)
NetLED155_4: LED155.4(DIN) LED156.2(DOUT)
NetLED156_4: LED156.4(DIN) LED157.2(DOUT)
NetLED157_4: LED157.4(DIN) LED158.2(DOUT)
NetLED158_4: LED158.4(DIN) LED159.2(DOUT)
NetLED159_4: LED159.4(DIN) LED160.2(DOUT)
NetLED160_4: LED160.4(DIN) LED161.2(DOUT)
NetLED161_4: LED161.4(DIN) LED162.2(DOUT)
NetLED162_4: LED162.4(DIN) LED163.2(DOUT)
NetLED163_4: LED163.4(DIN) LED164.2(DOUT)
NetLED164_4: LED164.4(DIN) LED165.2(DOUT)
NetLED165_4: LED165.4(DIN) LED166.2(DOUT)
NetLED166_4: LED166.4(DIN) LED167.2(DOUT)
NetLED167_4: LED167.4(DIN) LED168.2(DOUT)
NetLED169_4: LED169.4(DIN) LED170.2(DOUT)
NetLED170_4: LED170.4(DIN) LED171.2(DOUT)
NetLED171_4: LED171.4(DIN) LED172.2(DOUT)
NetLED172_4: LED172.4(DIN) LED173.2(DOUT)
NetLED173_4: LED173.4(DIN) LED174.2(DOUT)
NetLED174_4: LED174.4(DIN) LED175.2(DOUT)
NetLED175_4: LED175.4(DIN) LED176.2(DOUT)
NetLED176_4: LED176.4(DIN) LED177.2(DOUT)
NetLED177_4: LED177.4(DIN) LED178.2(DOUT)
NetLED178_4: LED178.4(DIN) LED179.2(DOUT)
NetLED179_4: LED179.4(DIN) LED180.2(DOUT)
NetLED180_4: LED180.4(DIN) LED181.2(DOUT)
NetLED181_4: LED181.4(DIN) LED182.2(DOUT)
NetLED182_4: LED182.4(DIN) LED183.2(DOUT)
NetLED183_4: LED183.4(DIN) LED184.2(DOUT)
NetLED184_4: LED184.4(DIN) LED185.2(DOUT)
NetLED185_4: LED185.4(DIN) LED186.2(DOUT)
NetLED186_4: LED186.4(DIN) LED187.2(DOUT)
NetLED187_4: LED187.4(DIN) LED188.2(DOUT)
NetLED188_4: LED188.4(DIN) LED189.2(DOUT)
NetLED189_4: LED189.4(DIN) LED190.2(DOUT)
NetLED190_4: LED190.4(DIN) LED191.2(DOUT)
NetLED191_4: LED191.4(DIN) LED192.2(DOUT)

### Library data of the parts
C1-C8 = Cap: Capacitor; Published: 8-Jun-2000; LatestRevisionDate: 17-Jul-2002; LatestRevisionNote: Re-released for DXP Platform.; PackageReference: RAD-0.3; Publisher: Altium Limited; PackageDescription: Radial Cap, Thru-Hole; 2 Leads; 0.3 in Pin Spacing
P1 = Header 3: Header, 3-Pin; LatestRevisionDate: 17-Jul-2002; LatestRevisionNote: Re-released for DXP Platform.; Publisher: Altium Limited